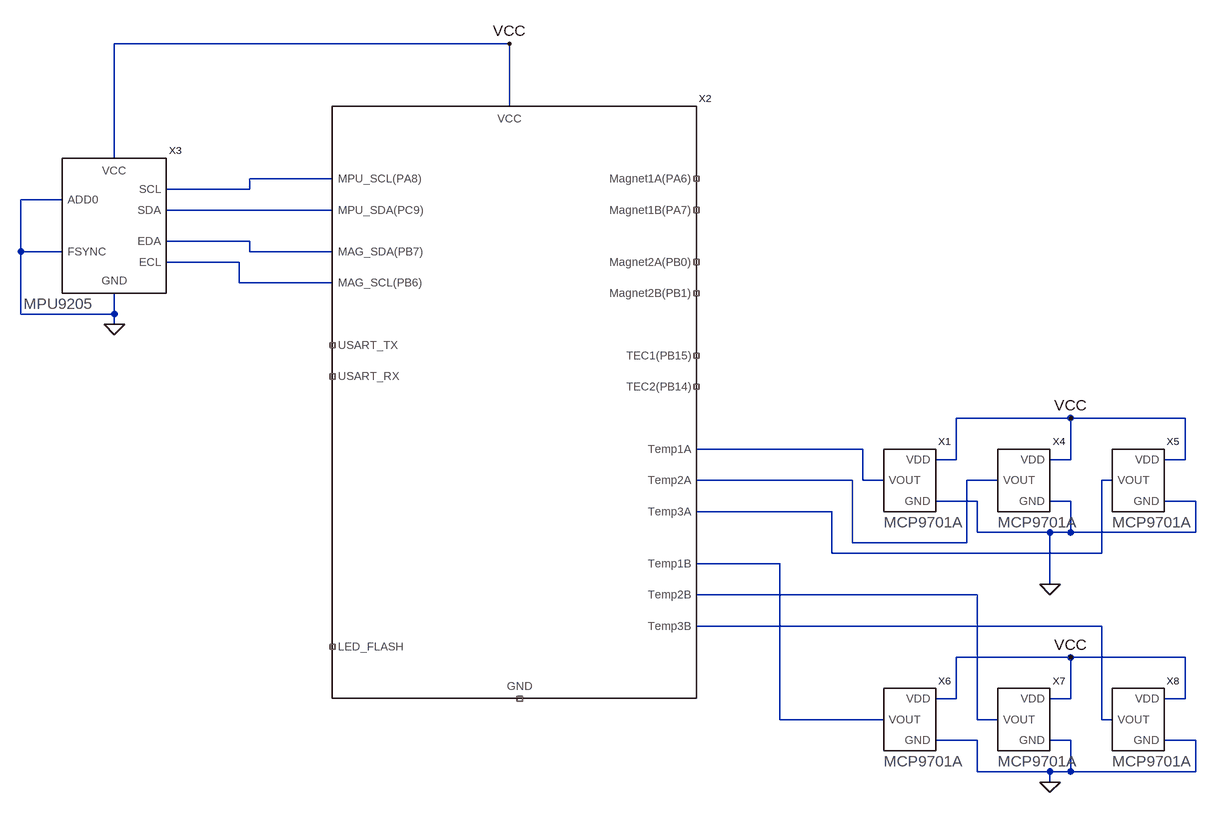
[diagram p0: schematic Main.asc]
Main.asc, the LTspice schematic file:
Version 4
SHEET 1 1228 740
WIRE -512 -432 -1120 -432
WIRE -512 -336 -512 -432
WIRE -1120 -256 -1120 -432
WIRE -784 -224 -912 -224
WIRE -912 -208 -912 -224
WIRE -912 -208 -1040 -208
WIRE -1200 -192 -1264 -192
WIRE -784 -176 -1040 -176
WIRE -912 -128 -1040 -128
WIRE -1264 -112 -1264 -192
WIRE -1200 -112 -1264 -112
WIRE -912 -112 -912 -128
WIRE -784 -112 -912 -112
WIRE -928 -96 -1040 -96
WIRE -928 -64 -928 -96
WIRE -784 -64 -928 -64
WIRE -1264 -16 -1264 -112
WIRE -1120 -16 -1120 -48
WIRE -1120 -16 -1264 -16
WIRE -1120 0 -1120 -16
WIRE 352 144 176 144
WIRE 528 144 352 144
WIRE 32 192 -224 192
WIRE 176 208 176 144
WIRE 176 208 144 208
WIRE 352 208 352 144
WIRE 352 208 320 208
WIRE 528 208 528 144
WIRE 528 208 496 208
WIRE 16 240 -224 240
WIRE 32 240 32 192
WIRE 64 240 32 240
WIRE 240 240 192 240
WIRE 416 240 400 240
WIRE 208 272 144 272
WIRE 352 272 320 272
WIRE 544 272 496 272
WIRE -16 288 -224 288
WIRE 208 320 208 272
WIRE 320 320 208 320
WIRE 352 320 352 272
WIRE 352 320 320 320
WIRE 544 320 544 272
WIRE 544 320 352 320
WIRE 16 336 16 240
WIRE 192 336 192 240
WIRE 192 336 16 336
WIRE -16 352 -16 288
WIRE 400 352 400 240
WIRE 400 352 -16 352
WIRE -96 368 -224 368
WIRE 320 400 320 320
WIRE 208 416 -224 416
WIRE 400 464 -224 464
WIRE 352 512 176 512
WIRE 528 512 352 512
WIRE 176 576 176 512
WIRE 176 576 144 576
WIRE 352 576 352 512
WIRE 352 576 320 576
WIRE 528 576 528 512
WIRE 528 576 496 576
WIRE -96 608 -96 368
WIRE 64 608 -96 608
WIRE 208 608 208 416
WIRE 240 608 208 608
WIRE 400 608 400 464
WIRE 416 608 400 608
WIRE 208 640 144 640
WIRE 352 640 320 640
WIRE 544 640 496 640
WIRE 208 688 208 640
WIRE 320 688 208 688
WIRE 352 688 352 640
WIRE 352 688 320 688
WIRE 544 688 544 640
WIRE 544 688 352 688
WIRE 320 704 320 688
FLAG -512 -432 VCC
FLAG -1120 0 0
FLAG 352 144 VCC
FLAG 320 400 0
FLAG 352 512 VCC
FLAG 320 704 0
SYMBOL MCP9701A 96 240 R0
SYMATTR InstName X1
SYMBOL MainBoard -800 32 R0
SYMATTR InstName X2
SYMBOL MPU9205 -1040 -208 R0
SYMATTR InstName X3
SYMBOL MCP9701A 272 240 R0
SYMATTR InstName X4
SYMBOL MCP9701A 448 240 R0
SYMATTR InstName X5
SYMBOL MCP9701A 96 608 R0
SYMATTR InstName X6
SYMBOL MCP9701A 272 608 R0
SYMATTR InstName X7
SYMBOL MCP9701A 448 608 R0
SYMATTR InstName X8

The netlist it stands for:
* Main.asc
XX1 VCC 0 N005 MCP9701A  ; pins VDD GND VOUT
XX2 VCC NC_01 N001 N002 NC_02 NC_03 NC_04 NC_05 NC_06 NC_07 N005 N008 N006 N009 N007 N010 NC_08 N004 N003 NC_09 NC_10 MainBoard  ; pins VCC GND MPU_SCL(PA8) MPU_SDA(PC9) Magnet1A(PA6) Magnet1B(PA7) Magnet2A(PB0) Magnet2B(PB1) TEC1(PB15) TEC2(PB14) Temp1A Temp1B Temp2A Temp2B Temp3A Temp3B LED_FLASH MAG_SCL(PB6) MAG_SDA(PB7) USART_TX USART_RX
XX3 N001 N002 N003 N004 VCC 0 0 0 MPU9205  ; pins SCL SDA EDA ECL VCC GND ADD0 FSYNC
XX4 VCC 0 N006 MCP9701A  ; pins VDD GND VOUT
XX5 VCC 0 N007 MCP9701A  ; pins VDD GND VOUT
XX6 VCC 0 N008 MCP9701A  ; pins VDD GND VOUT
XX7 VCC 0 N009 MCP9701A  ; pins VDD GND VOUT
XX8 VCC 0 N010 MCP9701A  ; pins VDD GND VOUT
.backanno
.end